# Altium schematic sheet 4.Port Interface.SchDoc
size A4
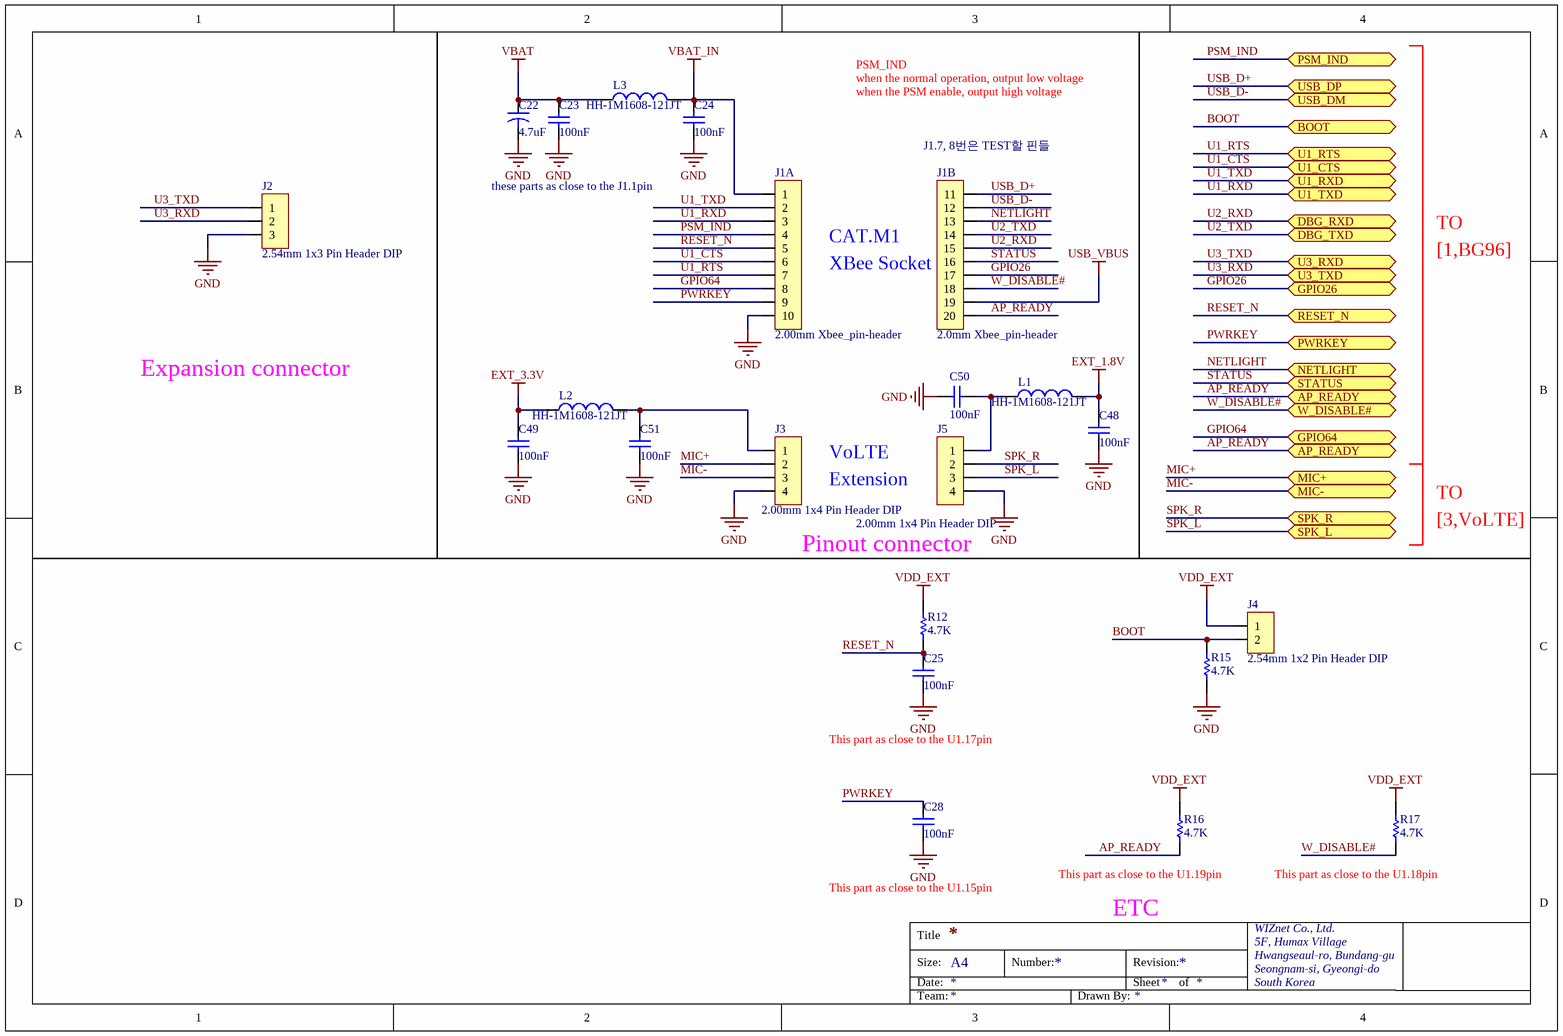
[diagram p0: 4.Port Interface.SchDoc]

## Parts
C22  4.7uF  [CAP-1206]
C23  100nF  [CAP-0402]
C24  100nF  [CAP-0402]
C25  100nF  [CAP-0402]
C28  100nF  [CAP-0402]
C48  100nF  [CAP-0402]
C49  100nF  [CAP-0402]
C50  100nF  [CAP-0402]
C51  100nF  [CAP-0402]
J1  2.00mm Xbee_pin-header  [Quectel CAT M1]  (parts A,B of 2)
J2  2.54mm 1x3 Pin Header DIP  [IDC-1X3]
J3  2.00mm 1x4 Pin Header DIP  [IDC(SMD)-1X4(2MM)]
J4  2.54mm 1x2 Pin Header DIP  [IDC-1X2]
J5  2.00mm 1x4 Pin Header DIP  [IDC(SMD)-1X4(2MM)]
L1  HH-1M1608-121JT  [IND-0603]
L2  HH-1M1608-121JT  [IND-0603]
L3  HH-1M1608-121JT  [IND-0603]
R12  4.7K  [RES-0402]
R15  4.7K  [RES-0402]
R16  4.7K  [RES-0402]
R17  4.7K  [RES-0402]

## Ports
AP_READY, BOOT, DBG_RXD, DBG_TXD, GPIO26, GPIO64, MIC+, MIC-, NETLIGHT, PSM_IND, PWRKEY, RESET_N, SPK_L, SPK_R, STATUS, U1_CTS, U1_RTS, U1_RXD, U1_TXD, U3_RXD, U3_TXD, USB_DM, USB_DP, W_DISABLE#

## Nets
EXT_1.8V: C48.1 L1.2
EXT_3.3V: C49.1 L2.1
GND: C22.2 C23.2 C24.2 C25.2 C28.2 C48.2 C49.2 C50.1 C51.2 J1.10 J2.3 J3.4 J5.4 R15.2
USB_VBUS: J1.19
VBAT: C22.1 C23.1 L3.1
VBAT_IN: C24.1 J1.1 L3.2
VDD_EXT: J4.1 R12.1 R16.1 R17.1
AP_READY: J1.20 R16.2 ; port AP_READY
BOOT: J4.2 R15.1 ; port BOOT
GPIO26: J1.17 ; port GPIO26
GPIO64: J1.8 ; port GPIO64
MIC+: J3.2 ; port MIC+
MIC-: J3.3 ; port MIC-
NETLIGHT: J1.13 ; port NETLIGHT
PSM_IND: J1.4 ; port PSM_IND
PWRKEY: C28.1 J1.9 ; port PWRKEY
RESET_N: C25.1 J1.5 R12.2 ; port RESET_N
SPK_L: J5.3 ; port SPK_L
SPK_R: J5.2 ; port SPK_R
STATUS: J1.16 ; port STATUS
U1_CTS: J1.6 ; port U1_CTS
U1_RTS: J1.7 ; port U1_RTS
U1_RXD: J1.3 ; port U1_TXD
U1_TXD: J1.2 ; port U1_RXD
U2_RXD: J1.15 ; port DBG_RXD
U2_TXD: J1.14 ; port DBG_TXD
U3_RXD: J2.2 ; port U3_TXD
U3_TXD: J2.1 ; port U3_RXD
USB_D+: J1.11 ; port USB_DP
USB_D-: J1.12 ; port USB_DM
W_DISABLE#: J1.18 R17.2 ; port W_DISABLE#
NetC50_2: C50.2 J5.1 L1.1
NetC51_1: C51.1 J3.1 L2.2

## Notes on the sheet
- PSM_IND
- when the normal operation, output low voltage
- when the PSM enable, output high voltage
- (near J1) J1.7, 8번은 TEST할 핀들
- these parts as close to the J1.1pin
- CAT.M1
- TO
- (near J1) XBee Socket
- [1,BG96]
- Expansion connector
- VoLTE
- Extension
- Pinout connector
- [3,VoLTE]
- This part as close to the U1.17pin
- This part as close to the U1.15pin
- (near R16) This part as close to the U1.19pin
- ETC
- (near R17) This part as close to the U1.18pin
- Title
- Size:
- Date:
- A4
- Number:
- Revision:
- Sheet
- of
- WIZnet Co., Ltd.
- 5F, Humax Village
- Hwangseaul-ro, Bundang-gu
- Seongnam-si, Gyeongi-do
- South Korea
- Team:
- Drawn By:

## Library data of the parts
C22 = CAP: Electrolytic Capacitors
C23-C25 C28 C48-C51 = CAP-0805: Ceramic CAP 0402
J1 = Xbee_pin-header: Xbee_pin-header, WizFi310, LoRa, LTE CAT M1
L1-L3 = IND-0603: Inductor 0603(1608)
R12 R15-R17 = RES-0402